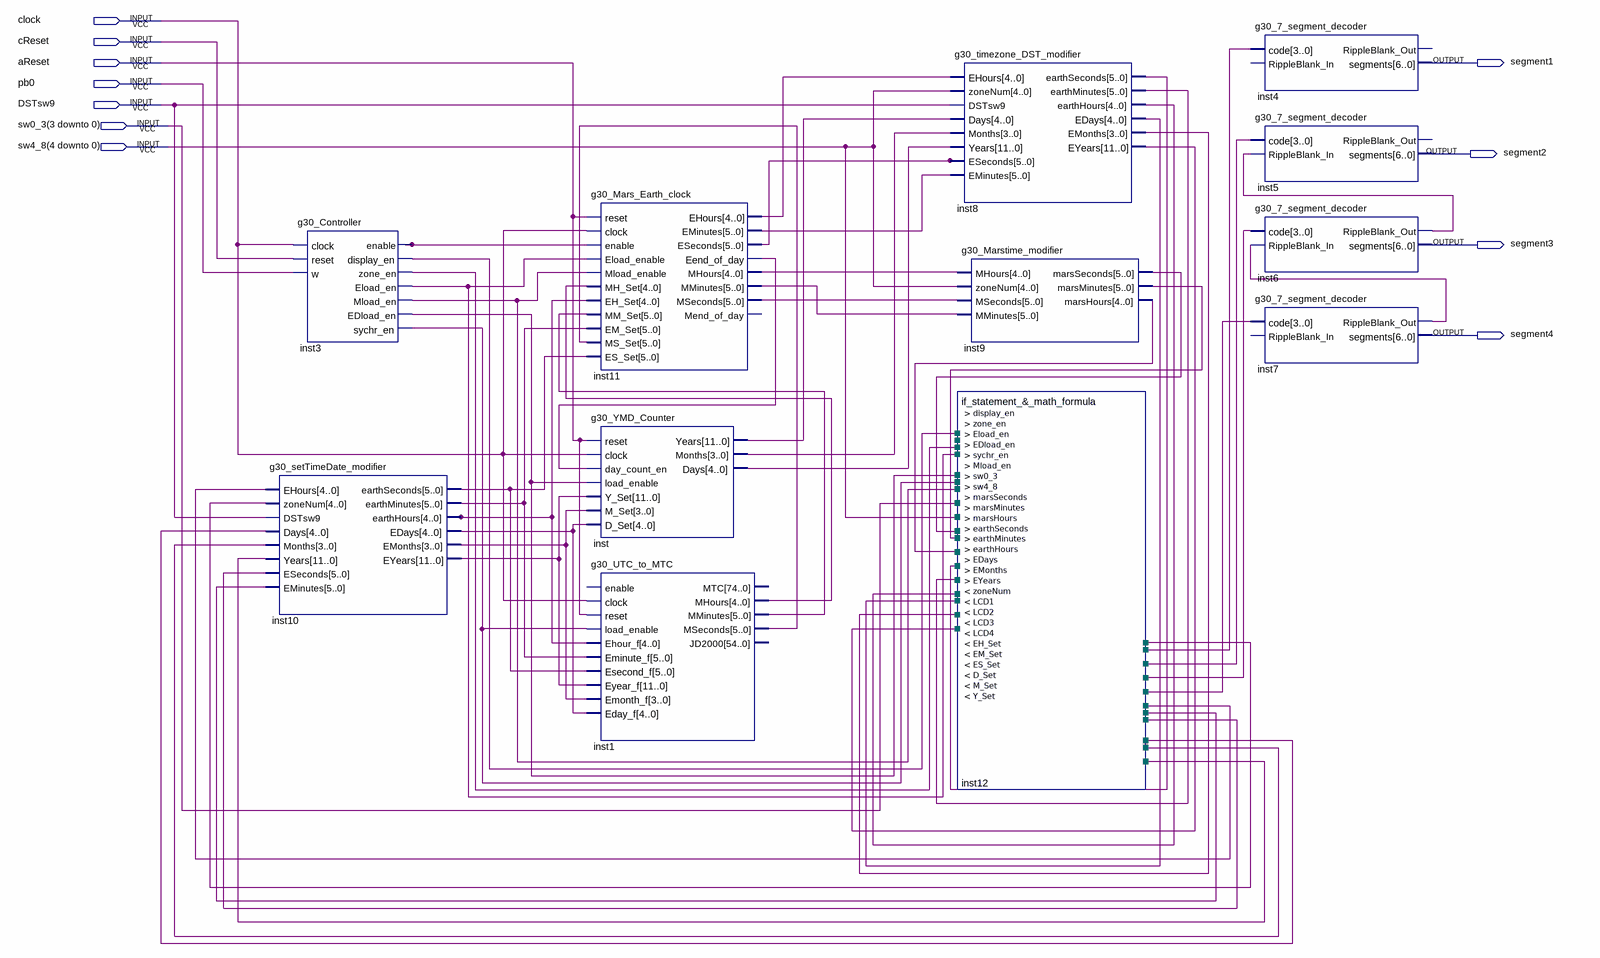
[diagram p0: schematic sheet]
// Quartus schematic g30_lab5.bdf as structural Verilog: 12 symbols, 11 pins
module g30_lab5 (
  input  clock,
  input  cReset,
  input  aReset,
  input  pb0,
  input  DSTsw9,
  input  \sw0_3(3_downto_0) ,
  input  \sw4_8(4_downto_0) ,
  output segment1,
  output segment2,
  output segment3,
  output segment4
);

  wire inst3_display_en, inst3_edload_en, inst3_eload_en, inst3_enable, inst3_mload_en, inst3_sychr_en,
       inst3_zone_en, inst6_rippleblank_out, inst7_rippleblank_out, inst8_earthhours, inst8_earthminutes,
       inst8_earthseconds, inst8_edays, inst8_emonths, inst8_eyears, inst9_marshours, inst9_marsminutes,
       inst9_marsseconds, inst11_eend_of_day, inst_days, inst_years, undriven, undriven_2, undriven_3,
       undriven_4, undriven_5, undriven_6, undriven_7, undriven_8, undriven_9, undriven_10, undriven_11;
  wire [3:0] inst10_emonths, inst_months;
  wire [4:0] inst1_mhours, inst10_earthhours, inst10_edays, inst11_ehours, inst11_mhours;
  wire [5:0] inst1_mminutes, inst1_mseconds, inst10_earthminutes, inst10_earthseconds, inst11_eminutes,
       inst11_eseconds, inst11_mminutes, inst11_mseconds;
  wire [11:0] inst10_eyears;

  g30_Controller inst3 (
    .clock(clock), .reset(cReset), .w(pb0), .enable(inst3_enable), .display_en(inst3_display_en),
    .zone_en(inst3_zone_en), .Eload_en(inst3_eload_en), .Mload_en(inst3_mload_en),
    .EDload_en(inst3_edload_en), .sychr_en(inst3_sychr_en));
  g30_setTimeDate_modifier inst10 (
    .EHours({5{undriven_5}}), .zoneNum({5{undriven_6}}), .DSTsw9(DSTsw9), .Days({5{undriven_11}}),
    .Months({4{undriven_10}}), .Years({12{undriven_9}}), .ESeconds({6{undriven_8}}),
    .EMinutes({6{undriven_7}}), .earthSeconds(inst10_earthseconds), .earthMinutes(inst10_earthminutes),
    .earthHours(inst10_earthhours), .EDays(inst10_edays), .EMonths(inst10_emonths), .EYears(inst10_eyears));
  g30_Mars_Earth_clock inst11 (
    .reset(aReset), .clock(clock), .enable(inst3_enable), .Eload_enable(inst3_eload_en),
    .Mload_enable(inst3_mload_en), .MH_Set(inst1_mhours), .EH_Set(inst10_earthhours),
    .MM_Set(inst1_mminutes), .EM_Set(inst10_earthminutes), .MS_Set(inst1_mseconds),
    .ES_Set(inst10_earthseconds), .EHours(inst11_ehours), .EMinutes(inst11_eminutes),
    .ESeconds(inst11_eseconds), .Eend_of_day(inst11_eend_of_day), .MHours(inst11_mhours),
    .MMinutes(inst11_mminutes), .MSeconds(inst11_mseconds));  // open: Mend_of_day
  g30_YMD_Counter inst (
    .reset(aReset), .clock(clock), .day_count_en(inst11_eend_of_day), .load_enable(inst3_edload_en),
    .Y_Set(inst10_eyears), .M_Set(inst10_emonths), .D_Set(inst10_edays), .Years(inst_years),
    .Months(inst_months), .Days(inst_days));
  g30_UTC_to_MTC inst1 (
    .clock(clock), .reset(aReset), .load_enable(inst3_sychr_en), .Ehour_f(inst10_earthhours),
    .Eminute_f(inst10_earthminutes), .Esecond_f(inst10_earthseconds), .Eyear_f(inst10_eyears),
    .Emonth_f(inst10_emonths), .Eday_f(inst10_edays), .MHours(inst1_mhours), .MMinutes(inst1_mminutes),
    .MSeconds(inst1_mseconds));  // open: enable, MTC, JD2000
  g30_timezone_DST_modifier inst8 (
    .EHours(inst11_ehours), .zoneNum({5{\sw4_8(4_downto_0) }}), .DSTsw9(DSTsw9), .Days({5{inst_years}}),
    .Months(inst_months), .Years({12{inst_days}}), .ESeconds(inst11_eseconds), .EMinutes(inst11_eminutes),
    .earthSeconds(inst8_earthseconds), .earthMinutes(inst8_earthminutes), .earthHours(inst8_earthhours),
    .EDays(inst8_edays), .EMonths(inst8_emonths), .EYears(inst8_eyears));
  g30_Marstime_modifier inst9 (
    .MHours(inst11_mhours), .zoneNum({5{\sw4_8(4_downto_0) }}), .MSeconds(inst11_mseconds),
    .MMinutes(inst11_mminutes), .marsSeconds(inst9_marsseconds), .marsMinutes(inst9_marsminutes),
    .marsHours(inst9_marshours));
  \if_statement_&_math_formula  inst12 ();  // open: display_en, zone_en, Eload_en, EDload_en, sychr_en, Mload_en, sw0_3, sw4_8, marsSeconds, marsMinutes, marsHours, earthSeconds, earthMinutes, earthHours, EDays, EMonths, EYears, zoneNum, LCD1, LCD2, LCD3, LCD4, EH_Set, EM_Set, ES_Set, D_Set, M_Set, Y_Set
  g30_7_segment_decoder inst4 (.code({4{undriven}}), .segments(segment1));  // open: RippleBlank_In, RippleBlank_Out
  g30_7_segment_decoder inst5 (
    .code({4{undriven_2}}), .RippleBlank_In(inst6_rippleblank_out));  // open: RippleBlank_Out, segments
  g30_7_segment_decoder inst6 (
    .code({4{undriven_3}}), .RippleBlank_In(inst7_rippleblank_out), .RippleBlank_Out(inst6_rippleblank_out),
    .segments(segment3));
  g30_7_segment_decoder inst7 (
    .code({4{undriven_4}}), .RippleBlank_Out(inst7_rippleblank_out), .segments(segment4));  // open: RippleBlank_In
endmodule
